# Altium schematic sheet 10_Wifi.SchDoc
size A4
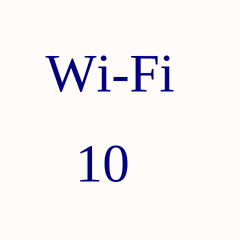
[diagram p0: 10_Wifi.SchDoc]

## Notes on the sheet
- Wi-Fi
- 10